# Altium schematic sheet Лист2.SchDoc
size A2
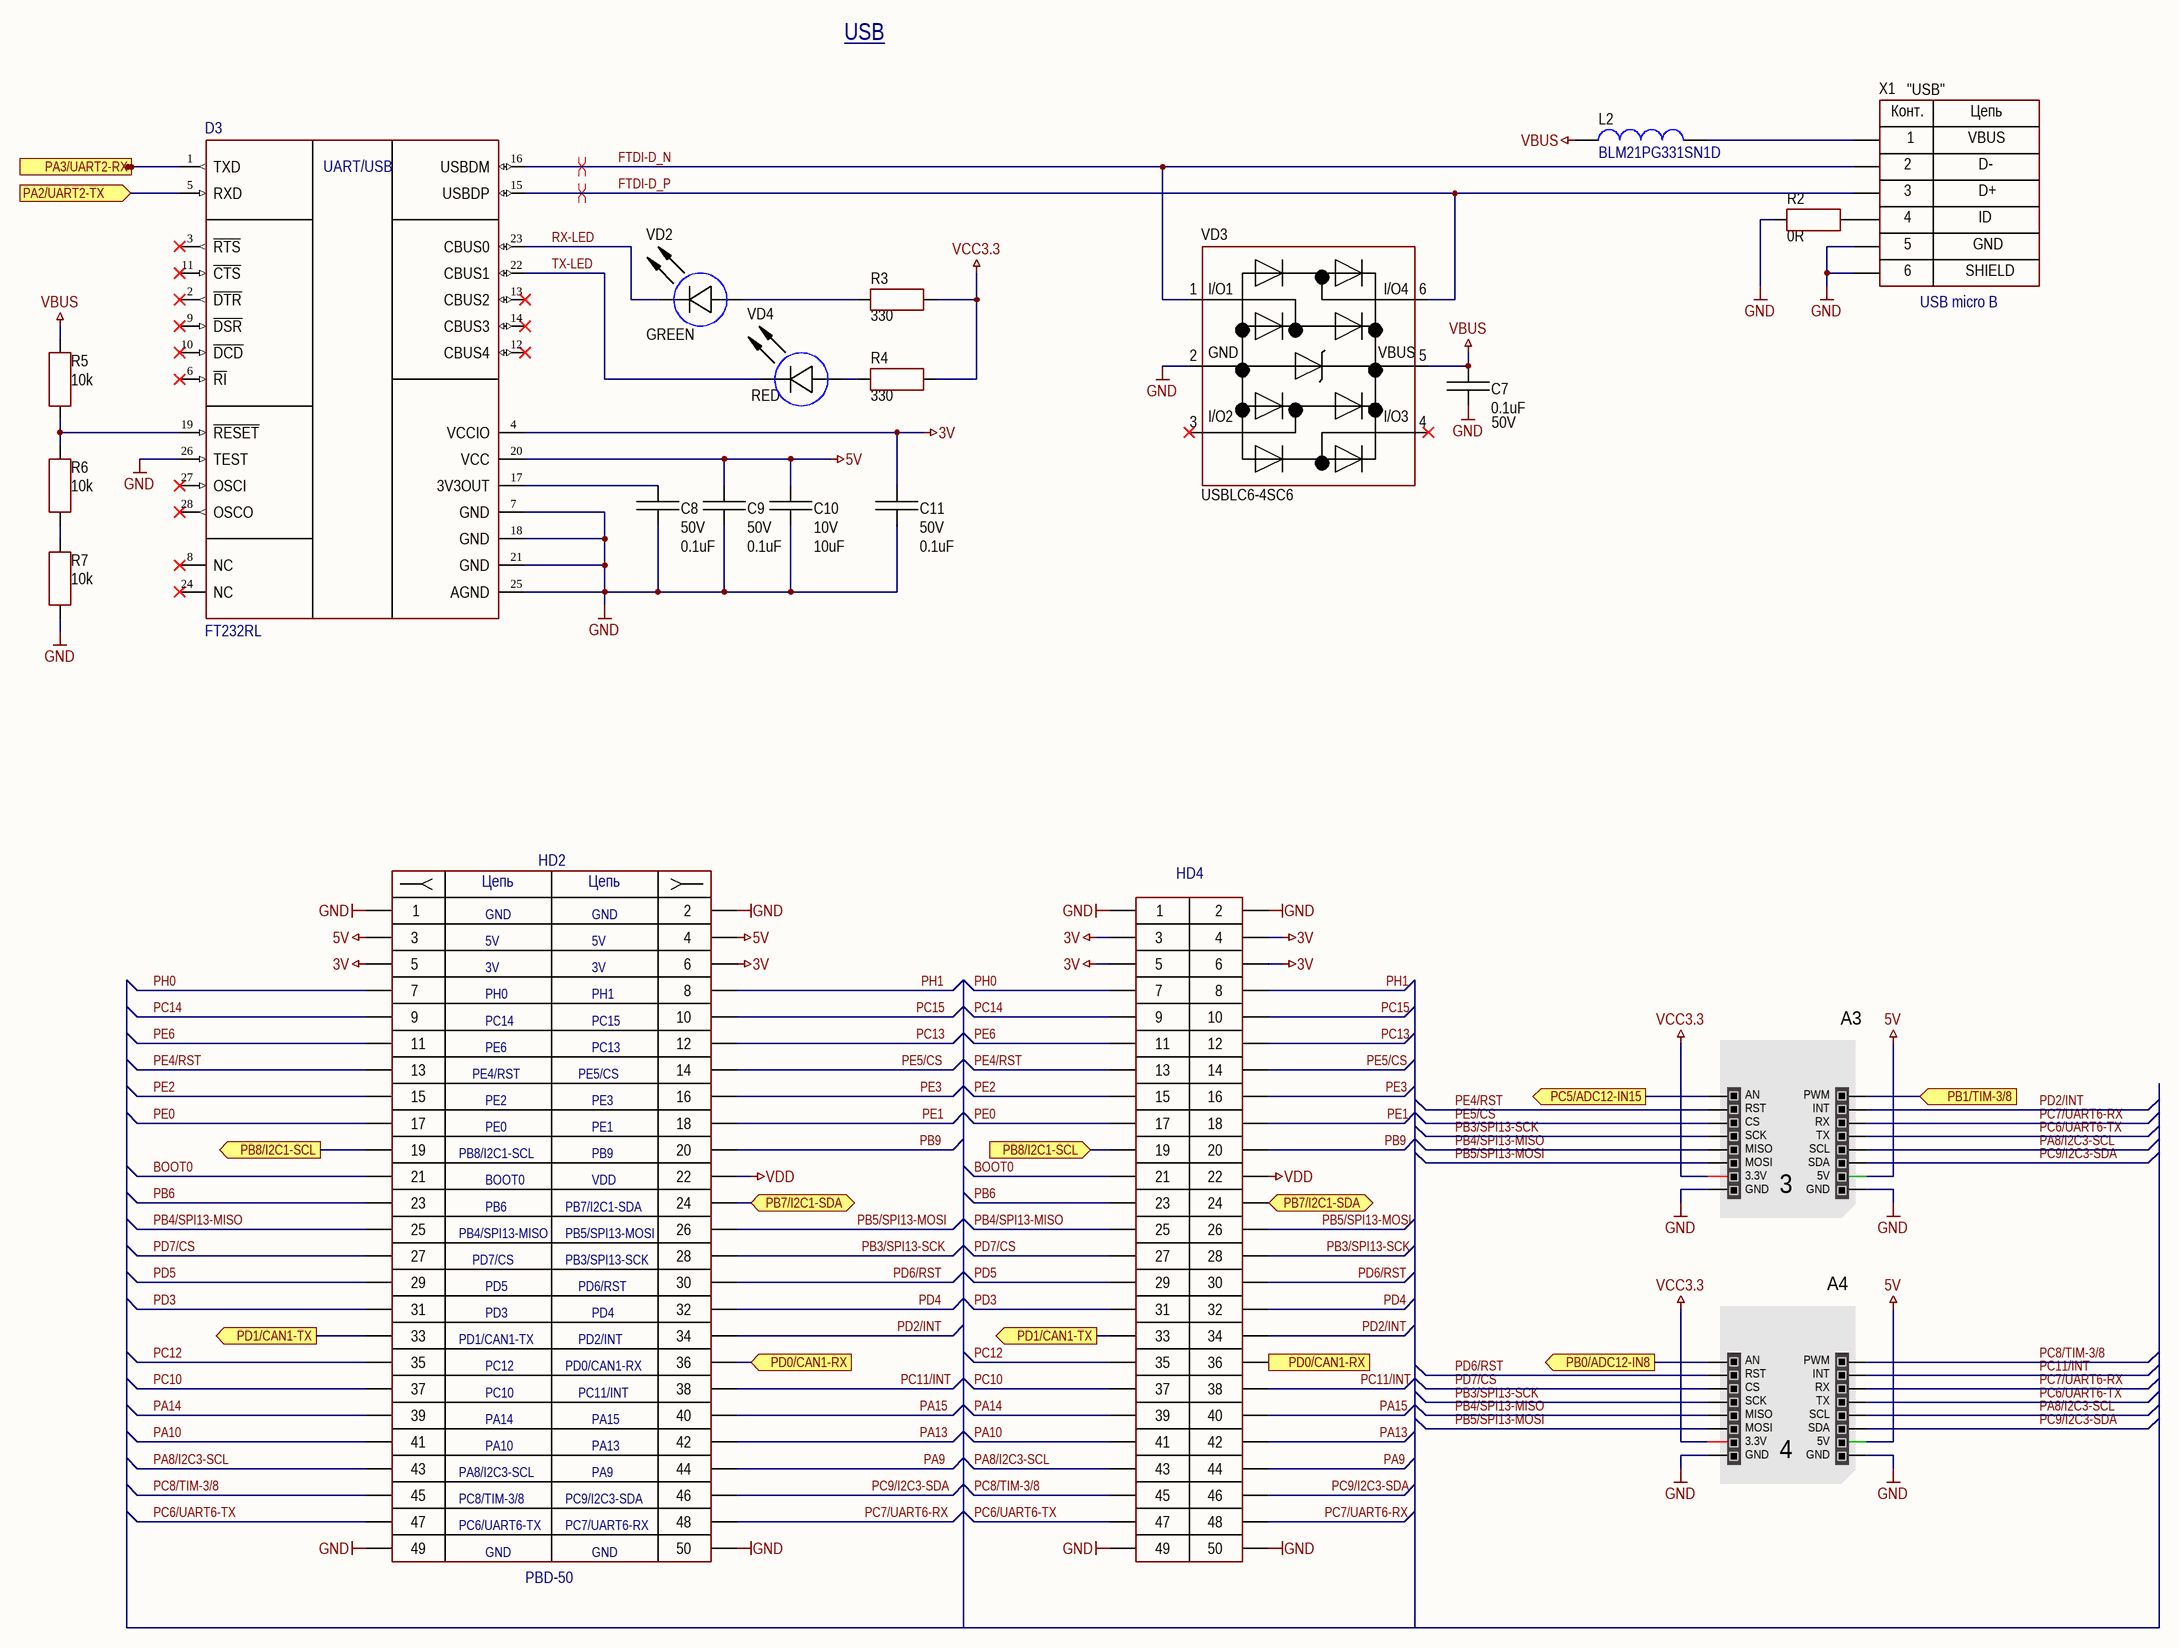
[diagram p0: Лист2.SchDoc]

## Parts
A3  MIKROBUS HOST CONN._1  [MIKROBUS HOST CONN.]  (value not drawn)
A4  MIKROBUS HOST CONN._1  [MIKROBUS HOST CONN.]  (value not drawn)
C7  value 0.1uF  Voltage: 50V  [CAP: 0603]
C8  value 0.1uF  Voltage: 50V  [CAP: 0603]
C9  value 0.1uF  Voltage: 50V  [CAP: 0603]
C10  value 10uF  Voltage: 10V  [CAP: 0805]
C11  value 0.1uF  Voltage: 50V  [CAP: 0603]
D3  FT232RL  [SSOP-28_N]
HD2  PBD-50  [CON: PBD-50]
HD4  PBD-50-1  [CON: PBD-50_NOT3D]  (value not drawn)
L2  BLM21PG331SN1D  [IND: 0805]
R2  value 0R  [RES: 0603]
R3  value 330  [RES: 0603]
R4  value 330  [RES: 0603]
R5  value 10k  [RES: 0603]
R6  value 10k  [RES: 0603]
R7  value 10k  [RES: 0603]
VD2  Color: GREEN  [LED: 0402B]
VD3  (no value)  [SOT23-6]
VD4  Color: RED  [LED: 0603R]
X1  TypeConnector: USB micro B  CommentText: "USB"  [CON: USB micro-A (ZX62-B-5PA)]

## Ports
PA2/UART2-TX (in), PA3/UART2-RX (out), PB0/ADC12-IN8 (out), PB1/TIM-3/8 (in), PB7/I2C1-SDA (bidir), PB8/I2C1-SCL (in), PB8/I2C1-SCL (out), PC5/ADC12-IN15 (out), PD0/CAN1-RX (in), PD1/CAN1-TX (out)

## Nets
3V: C11.2 D3.4(VCCIO) HD2.5 HD2.6 HD4.3 HD4.4 HD4.5 HD4.6
5V: A3.10(5V) A4.10(5V) C9.2 C10.2 D3.20(VCC) HD2.3 HD2.4
GND: A3.8(GND) A3.9(GND) A4.8(GND) A4.9(GND) C7.1 C8.1 C9.1 C10.1 C11.1 D3.7(GND) D3.18(GND) D3.21(GND) D3.25(AGND) D3.26(TEST) HD2.1 HD2.2 HD2.49 HD2.50 HD4.1 HD4.2 HD4.49 HD4.50 R2.1 R7.1 VD3.2(GND) X1.0 X1.5
VBUS: C7.2 L2.2 R5.2 VD3.5(VBUS)
VCC3.3: A3.7(3.3V) A4.7(3.3V) R3.2 R4.2
VDD: HD2.22 HD4.22
BOOT0: HD2.21 HD4.21
FTDI-D_N: D3.16(USBDM) VD3.1(I/O1) X1.2
FTDI-D_P: D3.15(USBDP) VD3.6(I/O4) X1.3
PA2/UART2-TX: D3.5(RXD) ; port PA2/UART2-TX
PA3/UART2-RX: D3.1(TXD) ; port PA3/UART2-RX
PA8/I2C3-SCL: A3.12(SCL) A4.12(SCL) HD2.43 HD4.43
PA9: HD2.44 HD4.44
PA10: HD2.41 HD4.41
PA13: HD2.42 HD4.42
PA14: HD2.39 HD4.39
PA15: HD2.40 HD4.40
PB0/ADC12-IN8: A4.1(AN) ; port PB0/ADC12-IN8
PB1/TIM-3/8: A3.16(PWM) ; port PB1/TIM-3/8
PB3/SPI13-SCK: A3.4(SCK) A4.4(SCK) HD2.28 HD4.28
PB4/SPI13-MISO: A3.5(MISO) A4.5(MISO) HD2.25 HD4.25
PB5/SPI13-MOSI: A3.6(MOSI) A4.6(MOSI) HD2.26 HD4.26
PB6: HD2.23 HD4.23
PB7/I2C1-SDA: HD2.24 HD4.24 ; port PB7/I2C1-SDA
PB8/I2C1-SCL: HD2.19 HD4.19 ; port PB8/I2C1-SCL
PB9: HD2.20 HD4.20
PC5/ADC12-IN15: A3.1(AN) ; port PC5/ADC12-IN15
PC6/UART6-TX: A3.13(TX) A4.13(TX) HD2.47 HD4.47
PC7/UART6-RX: A3.14(RX) A4.14(RX) HD2.48 HD4.48
PC8/TIM-3/8: A4.16(PWM) HD2.45 HD4.45
PC9/I2C3-SDA: A3.11(SDA) A4.11(SDA) HD2.46 HD4.46
PC10: HD2.37 HD4.37
PC11/INT: A4.15(INT) HD2.38 HD4.38
PC12: HD2.35 HD4.35
PC13: HD2.12 HD4.12
PC14: HD2.9 HD4.9
PC15: HD2.10 HD4.10
PD0/CAN1-RX: HD2.36 HD4.36 ; port PD0/CAN1-RX
PD1/CAN1-TX: HD2.33 HD4.33 ; port PD1/CAN1-TX
PD2/INT: A3.15(INT) HD2.34 HD4.34
PD3: HD2.31 HD4.31
PD4: HD2.32 HD4.32
PD5: HD2.29 HD4.29
PD6/RST: A4.2(RST) HD2.30 HD4.30
PD7/CS: A4.3(CS) HD2.27 HD4.27
PE0: HD2.17 HD4.17
PE1: HD2.18 HD4.18
PE2: HD2.15 HD4.15
PE3: HD2.16 HD4.16
PE4/RST: A3.2(RST) HD2.13 HD4.13
PE5/CS: A3.3(CS) HD2.14 HD4.14
PE6: HD2.11 HD4.11
PH0: HD2.7 HD4.7
PH1: HD2.8 HD4.8
RX-LED: D3.23(CBUS0) VD2.2(C)
TX-LED: D3.22(CBUS1) VD4.2(C)
NetC8_2: C8.2 D3.17(3V3OUT)
NetD3_19: D3.19(~{RESET}) R5.1 R6.2
NetL2_1: L2.1 X1.1
NetR2_2: R2.2 X1.4
NetR3_1: R3.1 VD2.1(A)
NetR4_1: R4.1 VD4.1(A)
NetR6_1: R6.1 R7.2

Not connected (* = marked no-connect by the designer): D3 2(~{DTR})* 3(~{RTS})* 6(~{RI})* 8(NC)* 9(~{DSR})* 10(~{DCD})* 11(~{CTS})* 12(CBUS4)* 13(CBUS2)* 14(CBUS3)* 24(NC)* 27(OSCI)* 28(OSCO)*; VD3 3(I/O2)* 4(I/O3)*

## Layout directives
differential pair: FTDI-D_N, FTDI-D_P

## Notes on the sheet
- USB
- (near HD2) GND
- (near HD2) 5V
- (near HD2) 3V
- (near HD2) PH0
- (near HD2) PH1
- (near HD2) PC14
- (near HD2) PE6
- (near HD2) PC15
- (near HD2) PC13
- (near HD2) PE4/RST
- (near HD2) PE2
- (near HD2) PE0
- (near HD2) PE5/CS
- (near HD2) PE3
- (near HD2) PE1
- (near HD2) PB8/I2C1-SCL
- (near HD2) BOOT0
- (near HD2) PB9
- (near HD2) VDD
- (near A3) 3
- (near HD2) PB4/SPI13-MISO
- (near HD2) PD7/CS
- (near HD2) PB6
- (near HD2) PB7/I2C1-SDA
- (near HD2) PB5/SPI13-MOSI
- (near HD2) PB3/SPI13-SCK
- (near HD2) PD5
- (near HD2) PD3
- (near HD2) PD6/RST
- (near HD2) PD4
- (near HD2) PD1/CAN1-TX
- (near HD2) PC12
- (near HD2) PC10
- (near HD2) PD0/CAN1-RX
- (near HD2) PD2/INT
- (near HD2) PC11/INT
- (near HD2) PA14
- (near HD2) PA10
- (near HD2) PA15
- (near HD2) PA13
- (near A4) 4
- (near HD2) PA8/I2C3-SCL
- (near HD2) PC8/TIM-3/8
- (near HD2) PC6/UART6-TX
- (near HD2) PC9/I2C3-SDA
- (near HD2) PC7/UART6-RX
- (near HD2) PA9
- (in symbol Connector_USB_micro_B) Конт.; Цепь; VBUS; D-; D+; ID; GND; 6; SHIELD
- (in symbol FT232RL) UART/USB
- (in symbol PBD-50) Цепь

## Library data of the parts
A3 = MIKROBUS HOST CONN._1: mikroBUS Host Socket; PartNumber: PBS-8 (2pcs); Manufacturer: Connfly; Number: 3; SMD: No; HelpURL: https://www.electronshik.ru/item/CONNFLY/PBS-8
A4 = MIKROBUS HOST CONN._1: mikroBUS Host Socket; PartNumber: PBS-8 (2pcs); Manufacturer: Connfly; Number: 4; SMD: No; HelpURL: https://www.electronshik.ru/item/CONNFLY/PBS-8
C7-C9 C11 = Ceramic_0603: Manufacturer: SAMSUNG; PartNumber: CL10B104KB8NNNC; ValueManufacturerPartNumber: Ceramic capacitor, 0.1uF, X7R, ±10%, 50V, 0603, -55...+125°C; TypeCapacitor: Ceramic capacitor; Tolerance: ±10%; TypeDielectric: X7R; Package: 0603; HelpURL: https://www.electronshik.ru/item/SAMSUNG/CL10B104KB8NNNC; Temperature: -55...+125°C
C10 = Ceramic_0805: Manufacturer: SAMSUNG; PartNumber: CL21A106KPFNNNE; ValueManufacturerPartNumber: Ceramic capacitor, 10uF, X5R, ±10%, 10V, 0805, -55...+125°C; TypeCapacitor: Ceramic capacitor; Tolerance: ±10%; TypeDielectric: X5R; Package: 0805; HelpURL: https://www.electronshik.ru/item/SAMSUNG/CL21A106KPFNNNE; Temperature: -55...+125°C
D3 = FT232RL: USB UART Asynchronous Serial Data Transfer Chip, SSOP-28, Tape and Reel; Manufacturer: FTDI; Supply: 5V; ComponentType: UART-USB; Package: SSOP-28; HelpURL: https://www.electronshik.ru/item/FTDI/FT232RL; PartNumber: FT232RL
HD2 = PBD-50: Розетка в 2 ряда; Manufacturer: Connfly Electronic; Part_Number: PBD-50 (DS1023-2x25); Value: *; Tolerance: *; RefDes/Designator: *; Pattern/Footprint: PBD-50; Publisher: TEN; Published: 2019; Type: Розетка; HelpURL: https://www.electronshik.ru/item/CONNFLY/PBD-50
HD4 = PBD-50-1: Пустое место; Manufacturer: Connfly Electronic; Part_Number: PBD-50; Value: *; Tolerance: *; RefDes/Designator: *; Pattern/Footprint: *; Publisher: TEN; Published: 2019; Type: Розетка; HelpURL: https://www.electronshik.ru/item/CONNFLY/PBD-50
L2 = EMI_SMD: Manufacturer: Murata Electronics; TypeInductor: Fixed inductor; MaxCurrent: 1500mA; Value: 330Ohm@100Mhz; PartNumber: BLM21PG331SN1D; Package: 0805; HelpURL: https://www.electronshik.ru/item/MUR/BLM21PG331SN1D; ValueManufacturerPartNumber: =TypeInductor+', '+Value+', '+Tolerance+', '+Package+', '+MaxCurrent+', '+Temperature; Temperature: -55...+125°C
R2 = Resistor_0603: Manufacturer: Yageo; PartNumber: RC0603JR-070RL; ValueManufacturerPartNumber: Resistor film, 0R, ±1%, 0603, 0.1W, -55...+125°C; TypeResistor: Resistor film; Power: 0.1W; Tolerance: ±1%; Package: 0603; HelpURL: https://www.electronshik.ru/item/YAG/RC0603JR-070RL; Temperature: -55...+125°C
R3 R4 = Resistor_0603: Manufacturer: Yageo; PartNumber: RC0603JR-07330RL; ValueManufacturerPartNumber: Resistor film, 330, ±1%, 0603, 0.1W, -55...+125°C; TypeResistor: Resistor film; Power: 0.1W; Tolerance: ±1%; Package: 0603; HelpURL: https://www.electronshik.ru/item/YAG/RC0603JR-074K7L; Temperature: -55...+125°C
R5-R7 = Resistor_0603: Manufacturer: Yageo; PartNumber: RC0603JR-0710KL; ValueManufacturerPartNumber: Resistor film, 10k, ±1%, 0603, 0.1W, -55...+125°C; TypeResistor: Resistor film; Power: 0.1W; Tolerance: ±1%; Package: 0603; HelpURL: https://www.electronshik.ru/item/YAG/RC0603JR-0710KL; Temperature: -55...+125°C
VD2 = LED_single: Manufacturer: Foryard; ValueManufacturerPartNumber: LED, *, *, *, -55...+150°C; PartNumber: FYLS-0603UGC; TypeDiode: LED; Package: *; HelpURL: https://www.electronshik.ru/item/FORYARD/FYLS-0603UGC; Temperature: -55...+150°C; Current: *; VoltageDrop: *
VD3 = USBLC6-4SC6: Manufacturer: ST Microelectronics; TypeDiode: USB ESD protection; Voltage: 5V; Package: SOT23-6L; HelpURL: https://www.electronshik.ru/item/ST/USBLC6-2SC6; ValueManufacturerPartNumber: =TypeDiode+', '+Voltage+', '+Current+', '+VoltageDrop+', '+RecoveryTime+', '+Package+', '+Temperature; Temperature: -55...+150°C; PartNumber: USBLC6-4SC6
VD4 = LED_single: Manufacturer: Foryard; ValueManufacturerPartNumber: LED, *, *, 0603, -55...+150°C; PartNumber: FYLS-0603URC / Foryard; TypeDiode: LED; Package: 0603; HelpURL: https://www.electronshik.ru/item/FORYARD/FYLS-0603URC; Temperature: -55...+150°C; Current: *; VoltageDrop: *
X1 = Connector_USB_micro_B: Manufacturer: Hirose Electric; PartNumber: ZX62-B-5PA; HelpURL: https://www.electronshik.ru/item/HI/ZX62-B-5PA%5B33%5D; ValueManufacturerPartNumber: USB micro B